# EAGLE design utorch (EAGLE 6.6.0)
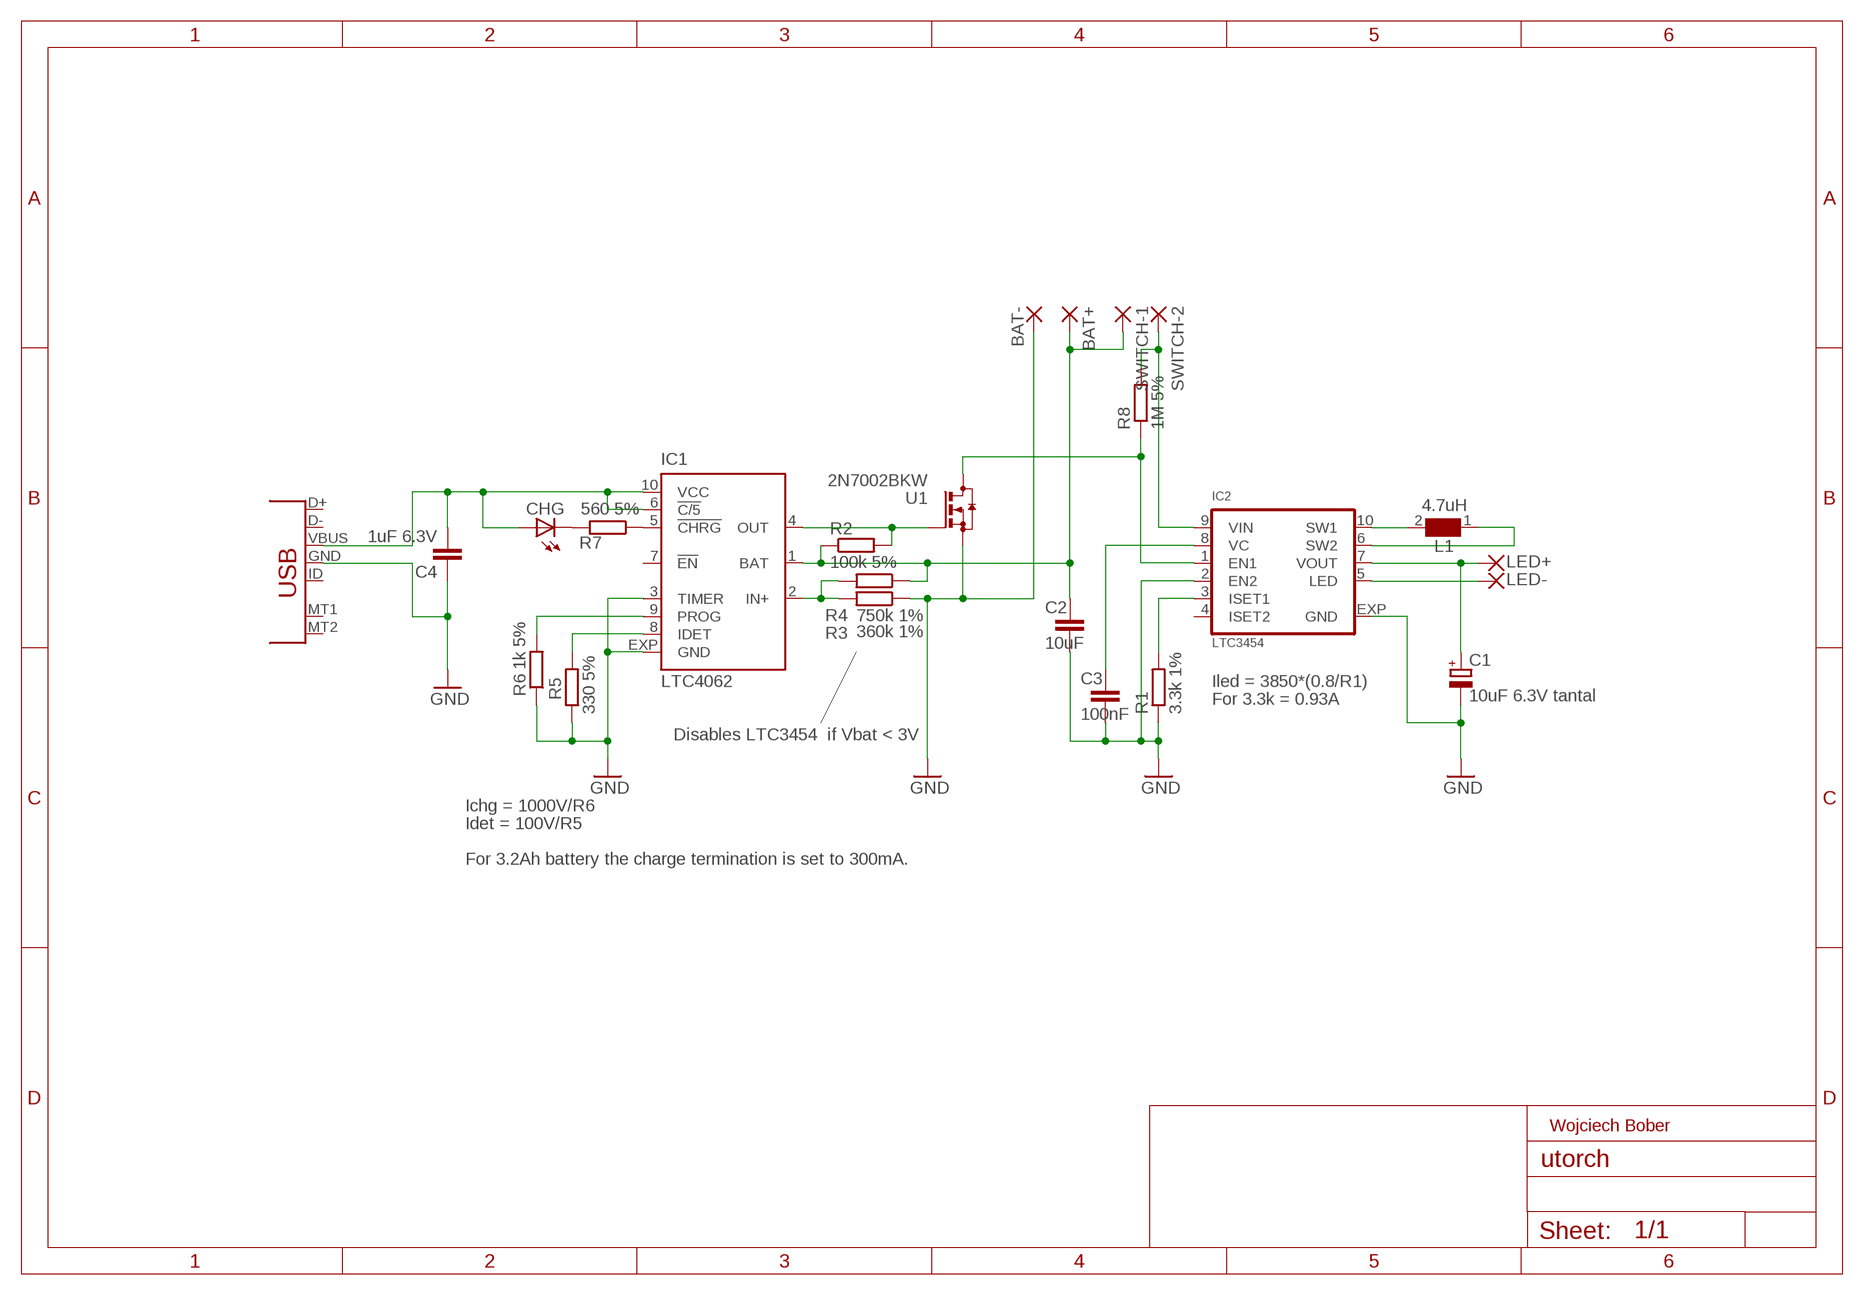
[diagram p0: schematic, sheet 1]
FRAME1 (A4L-LOC): AUTHOR: Wojciech Bober

## Parts
BAT+  WIREPAD1,6/0,8  [1,6/0,8]
BAT-  WIREPAD1,6/0,8  [1,6/0,8]
C1  10uF 6.3V tantal  CPOL-EUSMCA  [SMC_A]
C2  10uF  C-EUC0603  [C0603]
C3  100nF  C-EUC0402  [ADL_LIB_001_C0402]
C4  1uF 6.3V  C-EUC0402  [ADL_LIB_001_C0402]
CHG  LEDCHIP-LED0603  [CHIP-LED0603]
IC1  LTC4062  [DFN10-3X3]
IC2  LTC3454  [DFN10-3X3]
L1  4.7uH  WE-MAPI2510  [WE-MAPI_2510]
LED+  WIREPAD1,6/0,8  [1,6/0,8]
LED-  WIREPAD1,6/0,8  [1,6/0,8]
R1  3.3k 1%  R-EU_R0402  [ADL_LIB_001_R0402]
R2  100k 5%  R-EU_R0402  [ADL_LIB_001_R0402]
R3  360k 1%  R-EU_R0402  [ADL_LIB_001_R0402]
R4  750k 1%  R-EU_R0402  [ADL_LIB_001_R0402]
R5  330 5%  R-EU_R0402  [R0402]
R6  1k 5%  R-EU_R0402  [R0402]
R7  560 5%  R-EU_R0402  [R0402]
R8  1M 5%  R-EU_R0402  [ADL_LIB_001_R0402]
SWITCH-1  WIREPAD1,6/0,8  [1,6/0,8]
SWITCH-2  WIREPAD1,6/0,8  [1,6/0,8]
U1  2N7002BKW  [SOT323]
X1  USB-MICROB  [USB-MICROB]

## Nets
BAT+: BAT+.1(P) C2.1 IC1.1(BAT) R2.1 R4.1 SWITCH-1.1(P)
GND: BAT-.1(P) C1.- C2.2 C3.1 C4.1 IC1.3(TIMER) IC1.EXP(GND) IC2.2(EN2) IC2.EXP(GND) R1.1 R3.1 R5.1 R6.1 U1.2(S) X1.GND
N$1: IC2.10(SW1) L1.2
N$2: IC2.6(SW2) L1.1
N$3: IC2.5(LED) LED-.1(P)
N$4: C1.+ IC2.7(VOUT) LED+.1(P)
N$5: IC2.3(ISET1) R1.2
N$6: C3.2 IC2.8(VC)
N$7: IC2.9(VIN) R8.2 SWITCH-2.1(P)
N$8: IC1.8(IDET) R5.2
N$9: IC1.9(PROG) R6.2
N$10: IC1.4(OUT) R2.2 U1.1(G)
N$11: IC1.2(IN+) R3.2 R4.2
N$12: IC1.5(!CHRG) R7.1
N$13: CHG.C R7.2
N$14: C4.2 CHG.A IC1.6(!C/5) IC1.10(VCC) X1.VBUS
N$16: IC2.1(EN1) R8.1 U1.3(D)
Unconnected: IC1.7(!EN) IC2.4(ISET2) X1.D+ X1.D- X1.ID X1.MT1 X1.MT2

## Notes on the sheet
- Iled = 3850*(0.8/R1)
- For 3.3k = 0.93A
- Disables LTC3454  if Vbat < 3V
- Ichg = 1000V/R6
- Idet = 100V/R5
- For 3.2Ah battery the charge termination is set to 300mA.

## Library data of the parts
BAT+ BAT- LED+ LED- SWITCH-1 SWITCH-2 = wirepad:WIREPAD: Wire PAD connect wire on PCB
C1 = adl_lib_001:CPOL-EU: POLARIZED CAPACITOR, European symbol
C2 = rcl:C-EU: CAPACITOR, European symbol
C3 C4 = adl_lib_001:C-EU: CAPACITOR, European symbol
CHG = adl_lib_001:LED: LED OSRAM: - CHIPLED LG R971, LG N971, LY N971, LG Q971, LY Q971, LO R971, LY R971 LH N974, LH R974 LS Q976, LO Q976, LY Q976 LO Q996 - Hyper CHIPLED LW Q18S LB Q993, LB Q99A, LB R99A - SideLED LS A670, LO A670, LY A670, LG A670, LP A670 LB A673, LV A673, LT A673, LW A673 LH A674 LY A675 LS A676, LA A676, LO A676, LY A676, LW A676 LS A679, LY A679, LG A679 - Hyper Micro SIDELED® LS Y876, LA Y876, LO Y876, LY Y876 LT Y87S - SmartLED LW L88C, LW L88S LB L89C, LB L89S, LG L890 LS L89K, LO L89K, LY L89K LS L896, LA L896, LO L896, LY L896 - TOPLED LS T670, LO T670, LY T670, LG T670, LP T670 LSG T670, LSP T670, LSY T670, LOP T670, LYG T670 LG T671, LOG T671, LSG T671 LB T673, LV T673, LT T673, LW T673 LH T674 LS T676, LA T676, LO T676, LY T676, LB T676, LH T676, LSB T676, LW T676 LB T67C, LV T67C, LT T67C, LS T67K, LO T67K, LY T67K, LW E67C LS E67B, LA E67B, LO E67B, LY E67B, LB E67C, LV E67C, LT E67C LW T67C LS T679, LY T679, LG T679 LS T770, LO T770, LY T770, LG T770, LP T770 LB T773, LV T773, LT T773, LW T773 LH T774 LS E675, LA E675, LY E675, LS T675 LS T776, LA T776, LO T776, LY T776, LB T776 LHGB T686 LT T68C, LB T68C - Hyper Mini TOPLED® LB M676 - Mini TOPLED Santana® LG M470 LS M47K, LO M47K, LY M47K Source: http://www.osram.convergy.de LUXEON: - LUMILED® LXK2-PW12-R00, LXK2-PW12-S00, LXK2-PW14-U00, LXK2-PW14-V00 LXK2-PM12-R00, LXK2-PM12-S00, LXK2-PM14-U00 LXK2-PE12-Q00, LXK2-PE12-R00, LXK2-PE12-S00, LXK2-PE14-T00, LXK2-PE14-U00 LXK2-PB12-K00, LXK2-PB12-L00, LXK2-PB12-M00, LXK2-PB14-N00, LXK2-PB14-P00, LXK2-PB14-Q00 LXK2-PR12-L00, LXK2-PR12-M00, LXK2-PR14-Q00, LXK2-PR14-R00 LXK2-PD12-Q00, LXK2-PD12-R00, LXK2-PD12-S00 LXK2-PH12-R00, LXK2-PH12-S00 LXK2-PL12-P00, LXK2-PL12-Q00, LXK2-PL12-R00 Source: www.luxeon.com KINGBRIGHT: KA-3528ASYC Source: www.kingbright.com
IC1 = linear-technology:LTC4062: Standalone Linear Li-Ion Battery Charger with Micropower Comparator Source: http://www.linear.com .. 4062fa.pdf; MPN: LTC4062EDD#PBF; OC_FARNELL: 1648037; OC_NEWARK: 58M0900
IC2 = linear-technology:LTC3454
L1 = PowerMagnetics:WE-MAPI: WE-MAPI SMD Power Inductor Characteristics: - Magnetic iron alloy allows high rated currents - Compact design - Magnetically shielded - High current capability and handles high transient current spikes - No acoustic noise and no leakage flux noise - Quadrupled saturation current - Best efficiency - Minimized package - No EMI field - Operating temperature: –40 °C up to 125 °C Application: - DC/DC-converter for high current power supplies - DC/DC-converter for Field Programmable Gate Array (FPGA) - POL-converters - Portable power like PDA, digital camera - Mainboards/graphic cards - Battery powered devices - Wireless communication devices - Power supplies for smartphones,tablet PCs and other mobile devices <http://katalog.we-online.de/media/images/eisos/IndMAPI_pf2.jpg> Details see: http://katalog.we-online.de/en/pbs/WE-MAPI? Updated by Dan Xu 2014-07-08 2014 (C) Würth Elektronik
R1-R4 R8 = adl_lib_001:R-EU_: RESISTOR, European symbol
R5-R7 = resistor:R-EU_: RESISTOR, European symbol
U1 = WB:2N7002BKW: N-channel Trench MOSFET
X1 = adl_lib_001:USB: USB Connectors USB-B-PTH is fully proven SKU : PRT-00139 USB-miniB is fully proven SKU : PRT-00587 USB-A-PCB is untested. USB-A-H is throughly reviewed, but untested. Spark Fun Electronics SKU : PRT-00437 USB-B-SMT is throughly reviewed, but untested. Needs silkscreen touching up. USB-A-S has not been used/tested USB-MB-H has not been used/tested

## Board
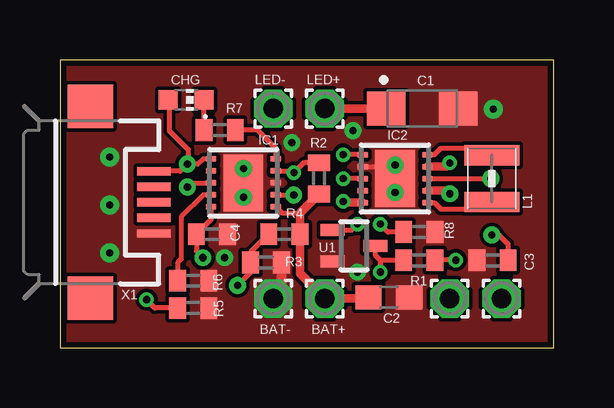
[diagram p1: board, top side]
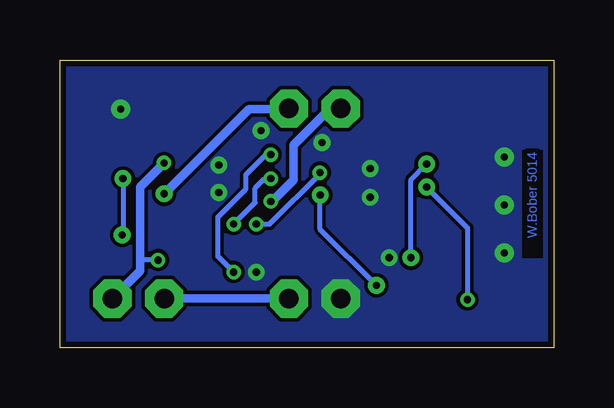
[diagram p2: board, bottom side, seen from below]

Size 20.6 x 12 mm. Coordinates in mm from the lower left corner, seen from the top.
Outline: 0,0 20.6,0 20.6,12 0,12 0,0
Copper layers (1*16): Top 0.035mm / dielectric 1.5mm / Bottom 0.035mm
Design rules "SeeedStudio_2layer_DRU_no_angle_20140221": minimum track width 6mil, minimum drill 12mil, track to track 6mil, track to pad 6mil, pad to pad 6mil, via to via 6mil, smd to smd 0mil, copper to edge 10mil, drill to drill 10mil, minimum pad ring 10mil, minimum via ring 6mil, stop-mask expansion 2mil, vias tented up to drill 100mil, thermal gap 10mil
bRestrict: area 0.5,3.8 to 1.3,8.2

### Footprints (pad centres in the part's own frame; a part is rotated, then mirrored left to right if it is on the bottom)
1,6/0,8 = drill 0.813 pad 1.6 octagon: 1 0,0
SMC_A = smd 1.6 x 1.4: + -1.5,0; - 1.5,0
C0603 = smd 1.1 x 1: 1 -0.85,0; 2 0.85,0
ADL_LIB_001_C0402 = smd 0.7 x 0.9: 1 -0.65,0; 2 0.65,0
CHIP-LED0603 = smd 0.8 x 0.8: A 0.75,0; C -0.75,0
DFN10-3X3 = smd 0.25 x 0.45: 1 -1,-1.35; 2 -0.5,-1.35; 3 0,-1.35; 4 0.5,-1.35; 5 1,-1.35; 6 1,1.35; 7 0.5,1.35; 8 0,1.35; 9 -0.5,1.35; 10 -1,1.35 | smd 2.38 x 1.65: EXP 0,0
WE-MAPI_2510 = smd 0.85 x 2.3: 1 -0.975,0; 2 0.975,0
ADL_LIB_001_R0402 = smd 0.7 x 0.9: 1 -0.65,0; 2 0.65,0
R0402 = smd 0.7 x 0.9: 1 -0.65,0; 2 0.65,0
SOT323 = smd 0.5 x 1: 1 -0.65,-0.9; 2 0.65,-0.9; 3 0,0.9
USB-MICROB = smd 0.35 x 1.4: D+ 0,2.65; D- -0.65,2.65; GND 1.3,2.65; ID 0.65,2.65; VBUS -1.3,2.65 | smd 1.8 x 1.9: MT1 -4,0; MT2 4,0

### Placement (x,y rotation side)
BAT+  11.05,2.05 0 top
BAT-  8.89,2.05 0 top
C1  15.1,9.97 0 top
C2  13.72,2.1 0 top
C3  18.04,3.64 0 top
C4  6.34,4.73 180 top
CHG  5.27,10.34 180 top
IC1  7.65,6.87 90 top
IC2  13.97,7.05 270 top
L1  18.01,7.05 90 top
LED+  11.05,9.97 0 top
LED-  8.89,9.97 0 top
R1  14.98,4.82 180 top
R2  10.8,7.06 90 top
R3  8.59,3.55 180 top
R4  9.36,4.73 180 top
R5  5.56,1.65 180 top
R6  5.56,2.79 180 top
R7  6.66,9.07 180 top
R8  14.98,3.64 0 top
SWITCH-1  16.26,2.05 0 top
SWITCH-2  18.41,2.05 0 top
U1  12.26,4.25 270 top
X1  1.27,6.06 270 top

### Tracks (layer width: path | path; a pad name or v marks a point on that pad's centre or on a via)
BAT+
  Top 0.2: IC1.1 9.25,5.62 10.01,5.62
  Top 0.35: 12.82,2.05 BAT+.1 10.01,3.09 R4.1 10.01,5.62 R2.1
  Top 0.4: 12.82,2.05 C2.1
  Top 0.406: R2.1
  Bottom 0.35: BAT+.1 SWITCH-1.1
GND  (via drill 0.3 pad 0.7, 0.3 pad 0.8)
  Top 0.2: IC2.2 13.98,7.55 v13.98,7.62
  Top 0.4: R3.1 9.24,2.4 BAT-.1
  other vias: 18.07,9.95 7.66,7.47 12.41,3.15 13.98,6.47 7.66,6.27 12.22,9.05 2.07,7.95 2.07,3.95 2.07,5.95 6.87,3.75 9.67,8.55
  pour Top (no thermals): 0,11.99 20.56,11.99 20.56,0.08 0,0.08
  pour Bottom (no thermals): 0,11.99 20.56,11.99 20.56,0.08 0,0.08
N$1
  Top 0.2: 17.88,8.05 L1.2 17.59,8.32 15.88,8.32 15.61,8.05 IC2.10
N$2
  Top 0.2: 17.88,6.05 L1.1 17.59,5.78 15.88,5.78 15.61,6.05 IC2.6
N$3  (via drill 0.3)
  Top 0.35: v11.81,6.1 11.86,6.05 IC2.5
  Bottom 0.35: LED-.1 9.34,9.97 10.86,8.45 10.86,7 11.76,6.1 v11.81,6.1
N$4  (via drill 0.3 pad 0.7)
  Top 0.35: IC2.7 16.12,6.55 v16.26,6.41 | LED+.1 C1.+
  Bottom 0.35: v16.26,6.41 12.72,9.95 11.05,9.95 LED+.1
N$5  (via drill 0.3)
  Top 0.2: IC2.3 11.76,7.05 v11.81,7.05 | R1.2 13.68,4.82 v13.36,5.15
  Bottom 0.2: v13.36,5.15 12.46,6.05 12.46,6.65 12.06,7.05 v11.81,7.05
N$6  (via drill 0.3 pad 0.7)
  Top 0.2: IC2.8 v17.97,7.05 | C3.2 18.69,4.32 18.31,4.7 v18.01,4.7
  Bottom 0.2: 17.91,7.05 v17.97,7.05 17.97,4.74 v18.01,4.7
N$7  (via drill 0.3)
  Top 0.2: v16.51,3.65 R8.2
  Top 0.35: v16.26,7.7 16.11,7.55 IC2.9
  Bottom 0.2: v16.51,3.65 17.26,3.65 17.26,3.21
  Bottom 0.35: SWITCH-2.1 17.26,3.21 17.26,6.7 v16.26,7.7
N$8  (via drill 0.3, 0.3 pad 0.7)
  Top 0.2: IC1.8 6.28,6.85 5.46,6.85 v5.31,6.7 | 3.91,1.7 v3.61,2 3.96,1.65 R5.2
  Bottom 0.2: v5.31,6.7 3.61,5 v3.61,2
N$9
  Top 0.2: IC1.9 5.98,6.37 5.06,5.45 5.06,4.85 5.06,3.69 4.91,3.54 4.91,3.2 R6.2
N$10  (via drill 0.3)
  Top 0.2: R2.2 10.17,7.71 v9.76,7.3 9.69,7.37 IC1.4 | 12.22,4.96 v12.41,5.15 12.16,4.9 U1.1
  Bottom 0.2: v9.76,7.3 9.76,7.25 11.86,5.15 v12.41,5.15
N$11  (via drill 0.3 pad 0.7)
  Top 0.2: IC1.2 9.7,6.37 v9.75,6.36 | v7.4,2.59 7.94,3.13 R3.2 7.94,3.98 R4.2
  Bottom 0.2: v7.4,2.59 9.75,4.93 v9.75,6.36
N$12
  Top 0.2: 9.02,7.89 IC1.5 9,8.31 8.24,9.07 R7.1
N$13
  Top 0.2: R7.2 CHG.C
N$14  (via drill 0.3 pad 0.7)
  Top 0.2: CHG.A 4.56,10.29 4.56,9.05 5.36,8.25 5.36,7.6 v5.31,7.65 | X1.VBUS 5.02,7.36 v5.31,7.65 | IC1.6 5.98,7.87 5.76,7.65 v5.31,7.65 | v5.96,3.75 5.69,4.03 C4.2 6.3,5.34 IC1.10
  Bottom 0.2: v5.96,3.75 5.96,7 v5.31,7.65
N$16  (via drill 0.3)
  Top 0.2: IC2.1 v11.81,8.05 | 13.11,4.2 U1.3 13.16,3.84 13.36,3.64 | 13.36,3.53 v13.36,3.15 13.36,3.64 | R8.1 13.36,3.64
  Bottom 0.2: v11.81,8.05 12.01,8.05 12.86,7.2 12.86,6.6 14.01,5.45 14.01,3.8 v13.36,3.15

### Text on the board
Bottom: W.Bober 5014
_tsilk: L+ | CHG | GND